# Altium project Inverter.PrjPcb (part 2 of 2)

## Sheet Buttons and Switches.SchDoc
size B
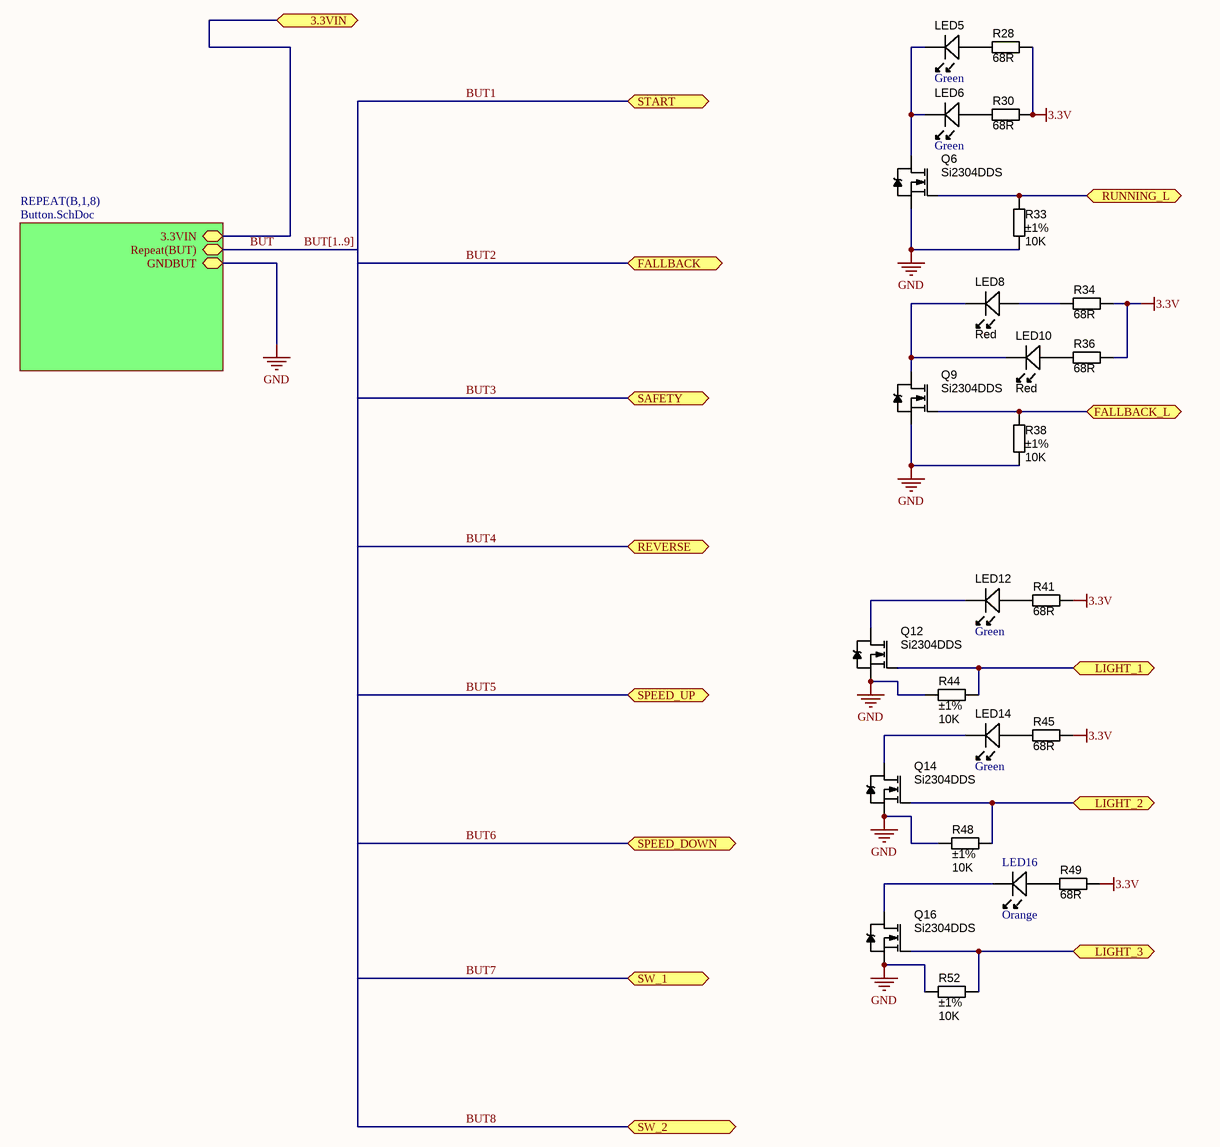
[diagram p3: Buttons and Switches.SchDoc]

### Parts
LED5  Color: Green  [LED-0603-GREEN]  (hidden comment: APT1608CGCK)
LED6  Color: Green  [LED-0603-GREEN]  (hidden comment: APT1608CGCK)
LED8  Red  [LED-0603-RED]
LED10  Red  [LED-0603-RED]
LED12  Color: Green  [LED-0603-GREEN]  (hidden comment: APT1608CGCK)
LED14  Color: Green  [LED-0603-GREEN]  (hidden comment: APT1608CGCK)
LED16  Color: Orange  [LED-0603-AMBER]  (hidden comment: LO L296-Q2S1-24-Z)
Q6  Si2304DDS  [SOT23-3]
Q9  Si2304DDS  [SOT23-3]
Q12  Si2304DDS  [SOT23-3]
Q14  Si2304DDS  [SOT23-3]
Q16  Si2304DDS  [SOT23-3]
R28  value 68R  [RESC1608X55N]  (hidden comment: Thick Film)
R30  value 68R  [RESC1608X55N]  (hidden comment: Thick Film)
R33  value 10K  Tolerance: ±1%  [RESC1005X40N]  (hidden comment: Thick Film)
R34  value 68R  [RESC1608X55N]  (hidden comment: Thick Film)
R36  value 68R  [RESC1608X55N]  (hidden comment: Thick Film)
R38  value 10K  Tolerance: ±1%  [RESC1005X40N]  (hidden comment: Thick Film)
R41  value 68R  [RESC1608X55N]  (hidden comment: Thick Film)
R44  value 10K  Tolerance: ±1%  [RESC1005X40N]  (hidden comment: Thick Film)
R45  value 68R  [RESC1608X55N]  (hidden comment: Thick Film)
R48  value 10K  Tolerance: ±1%  [RESC1005X40N]  (hidden comment: Thick Film)
R49  value 68R  [RESC1608X55N]  (hidden comment: Thick Film)
R52  value 10K  Tolerance: ±1%  [RESC1005X40N]  (hidden comment: Thick Film)

### Sub-sheets
REPEAT(B,1,8) = Button.SchDoc: 3.3VIN, Repeat(BUT), GNDBUT

### Ports
3.3VIN, FALLBACK, FALLBACK_L, LIGHT_1, LIGHT_2, LIGHT_3, REVERSE, RUNNING_L, SAFETY, SPEED_DOWN, SPEED_UP, START, SW_1, SW_2

### Nets
3.3V: R28.1 R30.1 R34.1 R36.1 R41.1 R45.1 R49.1 ; port 3.3VIN, sheet REPEAT(B,1,8)/3.3VIN
GND: Q6.2(S) Q9.2(S) Q12.2(S) Q14.2(S) Q16.2(S) R33.2 R38.2 R44.1 R48.1 R52.1 ; sheet REPEAT(B,1,8)/GNDBUT
BUT: sheet REPEAT(B,1,8)/Repeat(BUT)
FALLBACK_L: Q9.1(G) R38.1 ; port FALLBACK_L
LIGHT_1: Q12.1(G) R44.2 ; port LIGHT_1
LIGHT_2: Q14.1(G) R48.2 ; port LIGHT_2
LIGHT_3: Q16.1(G) R52.2 ; port LIGHT_3
RUNNING_L: Q6.1(G) R33.1 ; port RUNNING_L
NetLED5_A: LED5.A R28.2
NetLED5_K: LED5.K LED6.K Q6.3(D)
NetLED6_A: LED6.A R30.2
NetLED8_A: LED8.A R34.2
NetLED8_K: LED8.K LED10.K Q9.3(D)
NetLED10_A: LED10.A R36.2
NetLED12_A: LED12.A R41.2
NetLED12_K: LED12.K Q12.3(D)
NetLED14_A: LED14.A R45.2
NetLED14_K: LED14.K Q14.3(D)
NetLED16_A: LED16.A R49.2
NetLED16_K: LED16.K Q16.3(D)

### Buses and harness runs
bus BUT[1..9]

### Library data of the parts
LED5 LED6 LED12 LED14 = LED_SMD_Green_0603_50mcd: Green 570nm LED Indication - Discrete 2.1V 0603 (1608 Metric); Manufacturer: Kingbright; Lens Color: Colorless; Lens Transparency: Clear; Millicandela Rating: 50mcd; Lens Style/Size: Rectangle with Flat Top, 1.20mm x 0.80mm; Current - Test: 20mA; Viewing Angle: 120°; Wavelength - Peak: 574nm; Supplier 1: Digi-Key; Supplier Part Number 1: 754-1116-1-ND; Manufacturer Part Number: APT1608CGCK; Packaging: Cut Tape (CT); Part Status: Active; Voltage - Forward (Vf) (Typ): 2.1V; Mounting Type: Surface Mount; Wavelength - Dominant: 570nm; Features: -; Package / Case: 0603 (1608 Metric); Supplier Device Package: Chip LED; Size / Dimension: 1.60mm L x 0.80mm W; Height (Max): 0.75mm; ComponentLink1URL: http://www.kingbrightusa.com/images/catalog/SPEC/APT1608CGCK.pdf; ComponentLink1Description: http://www.kingbrightusa.com/images/catalog/SPEC/APT1608CGCK.pdf; RoHS: RoHS Compliant; Category: Optoelectronics; Stock 1: 896844; Pricing 1: 1=0.47, 10=0.337, 25=0.258, 100=0.1683, 250=0.12344, 500=0.10472, 1000=0.08602 (USD)
LED8 LED10 = LED_SMD_Red_0603_220mcd: LED 0603 SMD Hyper Red 630nm 220mcd 20mA; Manufacturer 1: Kingbright Company LLC; Manufacturer Part Number 1: APT1608SURCK; Material: AlGaInP on GaAs; Ratings: 220 mcd; 630 nm; Voltage - Forward (Vf) Typ: 1.95V; Voltage - Forward (Vf) @ 10mA: 1.9V; SCDType: source; Package / Case: 0603 (1608 metric); Supplier 1: Digi-Key; Supplier Part Number 1: 754-1123-1-ND; ComponentLink1URL: http://www.us.kingbright.com/images/catalog/SPEC/APT1608SURCK.pdf; ComponentLink1Description: http://www.us.kingbright.com/images/catalog/SPEC/APT1608SURCK.pdf
LED16 = LED_0603_Orange: LED ORANGE DIFFUSED 0603 SMD; Manufacturer: OSRAM Opto Semiconductors Inc.; Lens Color: White; Millicandela Rating: 157mcd; Lens Style/Size: Rectangle with Flat Top, 1.30mm x 0.80mm; Voltage - Forward (Vf) (Typ): 2V; Current - Test: 20mA; Viewing Angle: 160°; Wavelength - Dominant: 605nm; Supplier 1: Digi-Key; Manufacturer Part Number: LO L296-Q2S1-24-Z; Packaging: Cut Tape (CT); Part Status: Active; Lens Transparency: Diffused; Mounting Type: Surface Mount; Wavelength - Peak: -; Features: -; Package / Case: 0603 (1608 Metric); Size / Dimension: 1.70mm L x 0.80mm W; Height (Max): 0.65mm; ComponentLink1URL: http://www.osram-os.com/Graphics/XPic9/00077122_0.pdf; ComponentLink1Description: http://www.osram-os.com/Graphics/XPic9/00077122_0.pdf; Supplier Part Number 1: 475-2739-1-ND; RoHS: RoHS Compliant; Category: Optoelectronics; Stock 1: 4435; Pricing 1: 1=0.34, 10=0.245, 25=0.2004, 100=0.1603, 250=0.13524, 500=0.11522, 1000=0.09017, 2500=0.08349 (USD)
Q6 Q9 Q12 Q14 Q16 = MOSFET_Si2304DDS: MOSFET SMD N-CH 30V 3.6A 1.7W SOT23-3; Material: Metal Oxide; SCDType: source; Ratings: 30V; 3.6A; Package / Case: SOT23-3; Supplier 1: Digi-Key; Supplier Part Number 1: SI2304DDS-T1-GE3CT-ND
R28 R30 R34 R36 R41 R45 R49 = RES_68R_0603_5%: Resistor SMD chip 68 Ohm 0.1W 5% 0603; Manufacturer 1: Yageo; Manufacturer Part Number 1: RC0603JR-0768RL; Ratings: 1/10 W; SCDType: spec; Package / Case: 0603 (1608 metric); Tolerance: ±5%; Material: Thick Film; Supplier 1: Digi-Key; Supplier Part Number 1: 311-68GRCT-ND
R33 R38 R44 R48 R52 = RES_10K_0402_1%: Resistor SMD chip 10k Ohm 0.063W 1% 0402; Manufacturer 1: Vishay Dale; Manufacturer Part Number 1: CRCW040210K0FKED; Ratings: 1/16 W; SCDType: spec; Package / Case: 0402 (1005 Metric); Manufacturer 2: Yageo; Manufacturer Part Number 2: RC0402FR-0710KL; Supplier 1: Digi-Key; Supplier Part Number 1: 541-10.0KLCT-ND; ComponentLink1URL: http://www.vishay.com/doc?20035; ComponentLink1Description: http://www.vishay.com/doc?20035; Supplier 2: Digi-Key; Supplier Part Number 2: 311-10.0KLRCT-ND; ComponentLink2URL: http://www.yageo.com/documents/recent/PYu-RC0402_51_RoHS_L_6.pdf; ComponentLink2Description: http://www.yageo.com/documents/recent/PYu-RC0402_51_RoHS_L_6.pdf

## Sheet Button.SchDoc
size A
Used 8 times, as channels BUT/B1, BUT/B2, BUT/B3, BUT/B4, BUT/B5, BUT/B6, BUT/B7, BUT/B8. Parts and nets are listed once, with the designators drawn on the sheet.
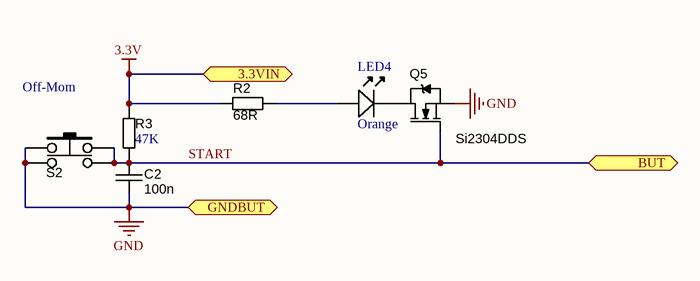
[diagram p4: Button.SchDoc]

### Parts
C2  value 100n  [CAPC1608X90N]  (hidden comment: approved sub OK)
LED4  Color: Orange  [LED-0603-AMBER]  (hidden comment: LO L296-Q2S1-24-Z)
Q5  Si2304DDS  [SOT23-3]
R2  value 68R  [RESC1608X55N]  (hidden comment: Thick Film)
R3  value 47K  [RESC1608X55N]  (hidden comment: Thick Film)
S2  Switch Function: Off-Mom  [SW_PVA1]  (hidden comment: SW_NO_MOM_PVA1 OA H1 1.2N V2)

### Ports
3.3VIN, BUT, GNDBUT

### Nets
3.3V: R2.1 R3.1 ; port 3.3VIN
GND: C2.2 Q5.2(S) S2.1 S2.1' ; port GNDBUT
START: C2.1 Q5.1(G) R3.2 S2.2 S2.2' ; port BUT
NetLED4_A: LED4.A R2.2
NetLED4_K: LED4.K Q5.3(D)

### Channels
BUT/B1: designators end in B1; ports 3.3VIN=3.3V BUT=BUT1 GNDBUT=GND
BUT/B2: designators end in B2; ports 3.3VIN=3.3V BUT=BUT2 GNDBUT=GND
BUT/B3: designators end in B3; ports 3.3VIN=3.3V BUT=BUT3 GNDBUT=GND
BUT/B4: designators end in B4; ports 3.3VIN=3.3V BUT=BUT4 GNDBUT=GND
BUT/B5: designators end in B5; ports 3.3VIN=3.3V BUT=BUT5 GNDBUT=GND
BUT/B6: designators end in B6; ports 3.3VIN=3.3V BUT=BUT6 GNDBUT=GND
BUT/B7: designators end in B7; ports 3.3VIN=3.3V BUT=BUT7 GNDBUT=GND
BUT/B8: designators end in B8; ports 3.3VIN=3.3V BUT=BUT8 GNDBUT=GND

### Library data of the parts
C2 = CAPC_100n_0603_X7R_50V_10%: Capacitor SMD Cer 100nF 10% 50V X7R 0603; Manufacturer: Murata Electronics North America; Manufacturer Part Number: GRM188R71H104KA93D; Tolerance: ±10%; Supplier 1: Digi-Key; Supplier Part Number 1: 490-1519-1-ND; RoHS: RoHS Compliant; Category: Capacitors; Stock 1: 21293840; Pricing 1: 1=0.12, 10=0.084, 100=0.0396, 500=0.02778, 1000=0.023 (USD); Packaging: Cut Tape (CT); Part Status: Active; Voltage - Rated: 50V; Temperature Coefficient: X7R; Operating Temperature: -55°C ~ 125°C; Features: -; Ratings: -; Applications: General Purpose; Mounting Type: Surface Mount, MLCC; Package / Case: 0603 (1608 Metric); Size / Dimension: 0.063" L x 0.031" W (1.60mm x 0.80mm); Height - Seated (Max): -; Thickness (Max): 0.035" (0.90mm); Lead Spacing: -; Lead Style: -; ComponentLink1URL: http://www.murata.com/~/media/webrenewal/support/library/catalog/products/capacitor/mlcc/c02e.pdf; ComponentLink1Description: http://www.murata.com/~/media/webrenewal/support/library/catalog/products/capacitor/mlcc/c02e.pdf
LED4 = LED_0603_Orange: as LED16 on sheet Buttons and Switches; Supplier 1: Digi-Key; Manufacturer Part Number: LO L296-Q2S1-24-Z; Packaging: Cut Tape (CT); Part Status: Active; Lens Transparency: Diffused; Mounting Type: Surface Mount; Wavelength - Peak: -; Features: -; Package / Case: 0603 (1608 Metric); Size / Dimension: 1.70mm L x 0.80mm W; Height (Max): 0.65mm; ComponentLink1URL: http://www.osram-os.com/Graphics/XPic9/00077122_0.pdf; ComponentLink1Description: http://www.osram-os.com/Graphics/XPic9/00077122_0.pdf; Supplier Part Number 1: 475-2739-1-ND; RoHS: RoHS Compliant; Category: Optoelectronics; Stock 1: 4435; Pricing 1: 1=0.34, 10=0.245, 25=0.2004, 100=0.1603, 250=0.13524, 500=0.11522, 1000=0.09017, 2500=0.08349 (USD)
Q5 = MOSFET_Si2304DDS: as Q6 on sheet Buttons and Switches; Package / Case: SOT23-3; Supplier 1: Digi-Key; Supplier Part Number 1: SI2304DDS-T1-GE3CT-ND
R2 = RES_68R_0603_5%: as R28 on sheet Buttons and Switches; Package / Case: 0603 (1608 metric); Tolerance: ±5%; Material: Thick Film; Supplier 1: Digi-Key; Supplier Part Number 1: 311-68GRCT-ND
R3 = RES_47K_0603_1%: Resistor SMD chip 47k Ohm 0.1W 1% 0603; Manufacturer 1: Panasonic Electronic Components; Manufacturer Part Number 1: ERJ-3EKF4702V; Description 1: RES SMD 47K OHM 1% 1/10W 0603; Power (Watts): 0.1W, 1/10W; Temperature Coefficient: ±100ppm/°C; Supplier 1: Digi-Key; Supplier Part Number 1: P47.0KHCT-ND; RoHS: RoHS Compliant; Category: Resistors; Stock 1: 1463956; Pricing 1: 1=0.1, 10=0.021, 100=0.0087, 1000=0.00389, 2500=0.00338 (USD); Packaging: Cut Tape (CT); Part Status: Active; Tolerance: ±1%; Composition: Thick Film; Features: Automotive AEC-Q200; Operating Temperature: -55°C ~ 155°C; Package / Case: 0603 (1608 Metric); Supplier Device Package: 0603; Size / Dimension: 0.063" L x 0.032" W (1.60mm x 0.80mm); Height - Seated (Max): 0.022" (0.55mm); Failure Rate: -; ComponentLink1URL: https://industrial.panasonic.com/cdbs/www-data/pdf/RDA0000/AOA0000C304.pdf; ComponentLink1Description: https://industrial.panasonic.com/cdbs/www-data/pdf/RDA0000/AOA0000C304.pdf
S2 = SW_NO_MOM_PVA1OAH11.2NV2: Low-profile captive tact switch; Manufacturer: C&K; Circuit: DPST-NO; Current Rating: 100mA (DC); Actuator Type: Plunger for Cap; Color - Actuator/Cap: White; Electrical Life: 100,000 Cycles; Supplier 1: Digi-Key; Supplier Part Number 1: 401-1133-ND; RoHS: RoHS Compliant; Category: Switches; Stock 1: 28581; Pricing 1: 1=1.23, 10=1.145, 25=1.09, 50=1.0356, 100=1.0083, 250=0.981, 500=0.9265, 1000=0.872, 5000=0.73575 (USD); Packaging: Bulk; Part Status: Active; Type: Keyswitch; Illumination Type, Color: -; Illumination Voltage (Nominal): -; Mounting Type: Through Hole; Termination Style: PC Pin; Ingress Protection: -; Features: -; Panel Cutout Dimensions: -; Operating Temperature: -40°C ~ 85°C; Mechanical Life: -; ComponentLink1URL: http://www.ckswitches.com/media/1343/pva.pdf; ComponentLink1Description: http://www.ckswitches.com/media/1343/pva.pdf; Manufacturer Part Number: PVA1 OA H1 1.2N V2

## Nets that join several sheets
3.3V: Inverter Main (13 pins), HB1 (R13_HB1.1 R14_HB1.1), HB2 (R13_HB2.1 R14_HB2.1), HB3 (R13_HB3.1 R14_HB3.1), 3.3V2.5A Microcontroller Power (6 pins), Buttons and Switches (7 pins), BUT/B1 (R2B1.1 R3B1.1), BUT/B2 (R2B2.1 R3B2.1), BUT/B3 (R2B3.1 R3B3.1), BUT/B4 (R2B4.1 R3B4.1), BUT/B5 (R2B5.1 R3B5.1), BUT/B6 (R2B6.1 R3B6.1), BUT/B7 (R2B7.1 R3B7.1), BUT/B8 (R2B8.1 R3B8.1)
3.3V_REF: Inverter Main (FB1.1 R24.1), 3.3V2.5A Microcontroller Power (C16.1 C17.1 U4.2)
15V: Inverter Main (7 pins), HB1 (C12_HB1.1 C13_HB1.1 D1HB1.A U3_HB1.5), HB2 (C12_HB2.1 C13_HB2.1 D1HB2.A U3_HB2.5), HB3 (C12_HB3.1 C13_HB3.1 D1HB3.A U3_HB3.5), 3.3V2.5A Microcontroller Power (6 pins)
350V: Inverter Main (P1.1 R21.1), HB1 (Q1_HB1.8), HB2 (Q1_HB2.8), HB3 (Q1_HB3.8)
GND: Inverter Main (28 pins), HB1 (19 pins), HB2 (19 pins), HB3 (19 pins), 3.3V2.5A Microcontroller Power (14 pins), Buttons and Switches (10 pins), BUT/B1 (C2B1.2 Q5B1.2 S2B1.1 S2B1.1'), BUT/B2 (C2B2.2 Q5B2.2 S2B2.1 S2B2.1'), BUT/B3 (C2B3.2 Q5B3.2 S2B3.1 S2B3.1'), BUT/B4 (C2B4.2 Q5B4.2 S2B4.1 S2B4.1'), BUT/B5 (C2B5.2 Q5B5.2 S2B5.1 S2B5.1'), BUT/B6 (C2B6.2 Q5B6.2 S2B6.1 S2B6.1'), BUT/B7 (C2B7.2 Q5B7.2 S2B7.1 S2B7.1'), BUT/B8 (C2B8.2 Q5B8.2 S2B8.1 S2B8.1')
BUT1: Inverter Main (U5.1), BUT/B1 (5 pins)
BUT2: Inverter Main (U5.16), BUT/B2 (5 pins)
BUT3: Inverter Main (U5.21), BUT/B3 (5 pins)
BUT4: Inverter Main (U5.30), BUT/B4 (5 pins)
BUT5: Inverter Main (U5.36), BUT/B5 (5 pins)
BUT6: Inverter Main (U5.34), BUT/B6 (5 pins)
BUT7: Inverter Main (U5.52), BUT/B7 (5 pins)
BUT8: Inverter Main (U5.55), BUT/B8 (5 pins)
FALLBACK_L: Inverter Main (U5.49), Buttons and Switches (Q9.1 R38.1)
HIN: Inverter Main (HIN1.1 U5.2), HB1 (Q4_HB1.1 R16_HB1.1 U3_HB1.1)
HIN: Inverter Main (HIN3.1 U5.60), HB3 (Q4_HB3.1 R16_HB3.1 U3_HB3.1)
HIN: Inverter Main (HIN2.1 U5.62), HB2 (Q4_HB2.1 R16_HB2.1 U3_HB2.1)
I_SENSE1: Inverter Main (TP9.1 U5.12), HB1 (C19HB1.1 R20HB1.1)
I_SENSE2: Inverter Main (TP10.1 U5.11), HB2 (C19HB2.1 R20HB2.1)
I_SENSE3: Inverter Main (TP8.1 U5.14), HB3 (C19HB3.1 R20HB3.1)
LIGHT_1: Inverter Main (U5.37), Buttons and Switches (Q12.1 R44.2)
LIGHT_2: Inverter Main (U5.50), Buttons and Switches (Q14.1 R48.2)
LIGHT_3: Inverter Main (U5.51), Buttons and Switches (Q16.1 R52.2)
LIN: Inverter Main (LIN1.1 U5.3), HB1 (Q3_HB1.1 R15_HB1.1 U3_HB1.2)
LIN: Inverter Main (LIN3.1 U5.61), HB3 (Q3_HB3.1 R15_HB3.1 U3_HB3.2)
LIN: Inverter Main (LIN2.1 U5.63), HB2 (Q3_HB2.1 R15_HB2.1 U3_HB2.2)
OUTPUT1: Inverter Main (P2.1), HB1 (TR1HB1.8)
OUTPUT2: Inverter Main (P2.2), HB2 (TR1HB2.8)
OUTPUT3: Inverter Main (P2.3), HB3 (TR1HB3.8)
RUNNING_L: Inverter Main (U5.43), Buttons and Switches (Q6.1 R33.1)